# EAGLE schematic ina_board (EAGLE 9.6.2)
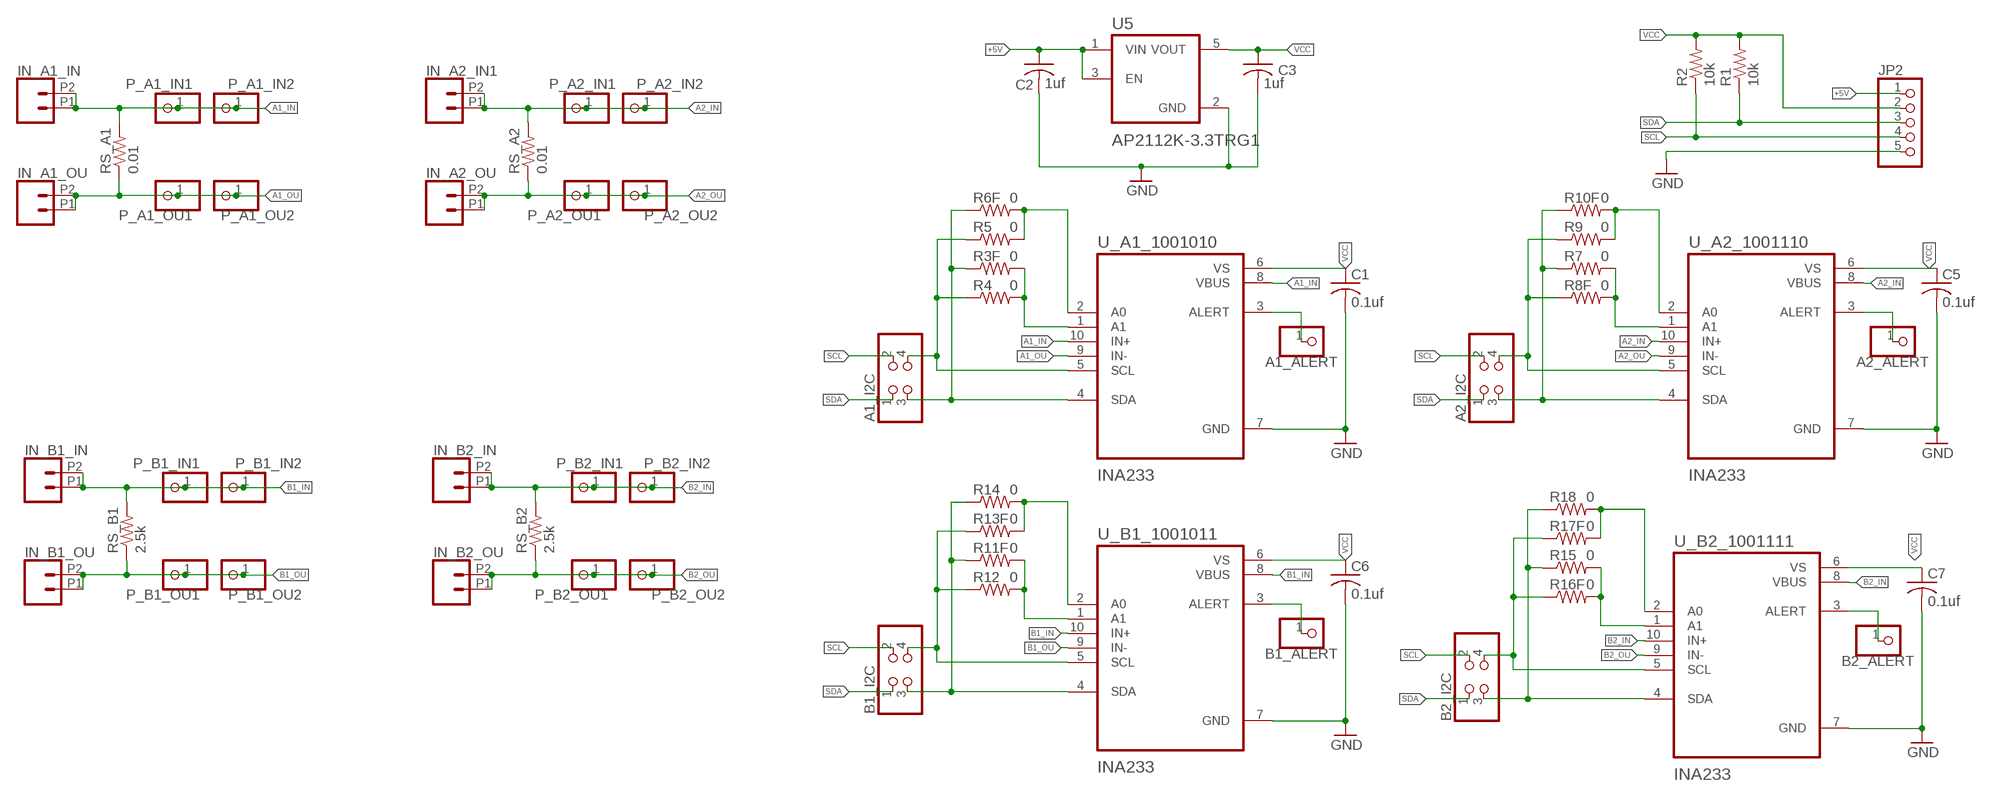
[diagram p0: schematic, sheet 1]

## Parts
A1_ALERT  PINHD-1X1  [1X01]
A1_I2C  PINHD-2X2  [2X02]
A2_ALERT  PINHD-1X1  [1X01]
A2_I2C  PINHD-2X2  [2X02]
B1_ALERT  PINHD-1X1  [1X01]
B1_I2C  PINHD-2X2  [2X02]
B2_ALERT  PINHD-1X1  [1X01]
B2_I2C  PINHD-2X2  [2X02]
C1  0.1uf  C-USC0805  [C0805]
C2  1uf  C-USC1210  [C1210]
C3  1uf  C-USC1210  [C1210]
C5  0.1uf  C-USC0805  [C0805]
C6  0.1uf  C-USC0805  [C0805]
C7  0.1uf  C-USC0805  [C0805]
IN_A1_IN  CONN_022.54MM_SCREWTERM  [1X02_2.54_SCREWTERM]
IN_A1_OU  CONN_022.54MM_SCREWTERM  [1X02_2.54_SCREWTERM]
IN_A2_IN1  CONN_022.54MM_SCREWTERM  [1X02_2.54_SCREWTERM]
IN_A2_OU  CONN_022.54MM_SCREWTERM  [1X02_2.54_SCREWTERM]
IN_B1_IN  CONN_022.54MM_SCREWTERM  [1X02_2.54_SCREWTERM]
IN_B1_OU  CONN_022.54MM_SCREWTERM  [1X02_2.54_SCREWTERM]
IN_B2_IN  CONN_022.54MM_SCREWTERM  [1X02_2.54_SCREWTERM]
IN_B2_OU  CONN_022.54MM_SCREWTERM  [1X02_2.54_SCREWTERM]
JP2  PINHD-1X5  [1X05]
P_A1_IN1  PINHD-1X1  [1X01]
P_A1_IN2  PINHD-1X1  [1X01]
P_A1_OU1  PINHD-1X1  [1X01]
P_A1_OU2  PINHD-1X1  [1X01]
P_A2_IN1  PINHD-1X1  [1X01]
P_A2_IN2  PINHD-1X1  [1X01]
P_A2_OU1  PINHD-1X1  [1X01]
P_A2_OU2  PINHD-1X1  [1X01]
P_B1_IN1  PINHD-1X1  [1X01]
P_B1_IN2  PINHD-1X1  [1X01]
P_B1_OU1  PINHD-1X1  [1X01]
P_B1_OU2  PINHD-1X1  [1X01]
P_B2_IN1  PINHD-1X1  [1X01]
P_B2_IN2  PINHD-1X1  [1X01]
P_B2_OU1  PINHD-1X1  [1X01]
P_B2_OU2  PINHD-1X1  [1X01]
R1  10k  R-US_R0805  [R0805]
R2  10k  R-US_R0805  [R0805]
R3F  0  R-US_R0805  [R0805]
R4  0  R-US_R0805  [R0805]
R5  0  R-US_R0805  [R0805]
R6F  0  R-US_R0805  [R0805]
R7  0  R-US_R0805  [R0805]
R8F  0  R-US_R0805  [R0805]
R9  0  R-US_R0805  [R0805]
R10F  0  R-US_R0805  [R0805]
R11F  0  R-US_R0805  [R0805]
R12  0  R-US_R0805  [R0805]
R13F  0  R-US_R0805  [R0805]
R14  0  R-US_R0805  [R0805]
R15  0  R-US_R0805  [R0805]
R16F  0  R-US_R0805  [R0805]
R17F  0  R-US_R0805  [R0805]
R18  0  R-US_R0805  [R0805]
RS_A1  0.01  R-US_R2512  [R2512]
RS_A2  0.01  R-US_R2512  [R2512]
RS_B1  2.5k  R-US_R0805  [R0805]
RS_B2  2.5k  R-US_R0805  [R0805]
U5  AP2112K-3.3TRG1  [SOT95P285X140-5N]
U_A1_1001010  INA233  INA226AIDGST  [SOP50P490X110-10N]
U_A2_1001110  INA233  INA226AIDGST  [SOP50P490X110-10N]
U_B1_1001011  INA233  INA226AIDGST  [SOP50P490X110-10N]
U_B2_1001111  INA233  INA226AIDGST  [SOP50P490X110-10N]

## Nets
+5V: C2.1 JP2.1 U5.1(VIN) U5.3(EN)
A1_IN: IN_A1_IN.P1 IN_A1_IN.P2 P_A1_IN1.1 P_A1_IN2.1 RS_A1.2 U_A1_1001010.8(VBUS) U_A1_1001010.10(IN+)
A1_OU: IN_A1_OU.P1 IN_A1_OU.P2 P_A1_OU1.1 P_A1_OU2.1 RS_A1.1 U_A1_1001010.9(IN-)
A2_IN: IN_A2_IN1.P1 IN_A2_IN1.P2 P_A2_IN1.1 P_A2_IN2.1 RS_A2.2 U_A2_1001110.8(VBUS) U_A2_1001110.10(IN+)
A2_OU: IN_A2_OU.P1 IN_A2_OU.P2 P_A2_OU1.1 P_A2_OU2.1 RS_A2.1 U_A2_1001110.9(IN-)
B1_IN: IN_B1_IN.P1 IN_B1_IN.P2 P_B1_IN1.1 P_B1_IN2.1 RS_B1.2 U_B1_1001011.8(VBUS) U_B1_1001011.10(IN+)
B1_OU: IN_B1_OU.P1 IN_B1_OU.P2 P_B1_OU1.1 P_B1_OU2.1 RS_B1.1 U_B1_1001011.9(IN-)
B2_IN: IN_B2_IN.P1 IN_B2_IN.P2 P_B2_IN1.1 P_B2_IN2.1 RS_B2.2 U_B2_1001111.8(VBUS) U_B2_1001111.10(IN+)
B2_OU: IN_B2_OU.P1 IN_B2_OU.P2 P_B2_OU1.1 P_B2_OU2.1 RS_B2.1 U_B2_1001111.9(IN-)
GND: C1.2 C2.2 C3.2 C5.2 C6.2 C7.2 JP2.5 U5.2(GND) U_A1_1001010.7(GND) U_A2_1001110.7(GND) U_B1_1001011.7(GND) U_B2_1001111.7(GND)
N$3: A2_I2C.4 R8F.1 R9.1 U_A2_1001110.5(SCL)
N$4: A2_I2C.3 R7.1 R10F.1 U_A2_1001110.4(SDA)
N$5: A1_ALERT.1 U_A1_1001010.3(ALERT)
N$6: R7.2 R8F.2 U_A2_1001110.1(A1)
N$7: A1_I2C.4 R4.1 R5.1 U_A1_1001010.5(SCL)
N$8: A1_I2C.3 R3F.1 R6F.1 U_A1_1001010.4(SDA)
N$9: R3F.2 R4.2 U_A1_1001010.1(A1)
N$10: R5.2 R6F.2 U_A1_1001010.2(A0)
N$11: R9.2 R10F.2 U_A2_1001110.2(A0)
N$12: A2_ALERT.1 U_A2_1001110.3(ALERT)
N$17: B1_I2C.4 R12.1 R13F.1 U_B1_1001011.5(SCL)
N$18: B1_I2C.3 R11F.1 R14.1 U_B1_1001011.4(SDA)
N$19: R11F.2 R12.2 U_B1_1001011.1(A1)
N$20: R13F.2 R14.2 U_B1_1001011.2(A0)
N$21: B1_ALERT.1 U_B1_1001011.3(ALERT)
N$26: B2_I2C.4 R16F.1 R17F.1 U_B2_1001111.5(SCL)
N$27: B2_I2C.3 R15.1 R18.1 U_B2_1001111.4(SDA)
N$28: R15.2 R16F.2 U_B2_1001111.1(A1)
N$29: R17F.2 R18.2 U_B2_1001111.2(A0)
N$30: B2_ALERT.1 U_B2_1001111.3(ALERT)
SCL: A1_I2C.2 A2_I2C.2 B1_I2C.2 B2_I2C.2 JP2.4 R2.1
SDA: A1_I2C.1 A2_I2C.1 B1_I2C.1 B2_I2C.1 JP2.3 R1.1
VCC: C1.1 C3.1 C5.1 C6.1 C7.1 JP2.2 R1.2 R2.2 U5.5(VOUT) U_A1_1001010.6(VS) U_A2_1001110.6(VS) U_B1_1001011.6(VS) U_B2_1001111.6(VS)

## Library data of the parts
A1_ALERT A2_ALERT B1_ALERT B2_ALERT = pinhead:PINHD-1X1: PIN HEADER
A1_I2C A2_I2C B1_I2C B2_I2C = pinhead:PINHD-2X2: PIN HEADER
C1-C3 C5-C7 = rcl:C-US: CAPACITOR, American symbol; SPICEPREFIX: C
IN_A1_IN IN_A1_OU IN_A2_IN1 IN_A2_OU IN_B1_IN IN_B1_OU IN_B2_IN IN_B2_OU = SparkFun-Connectors:CONN_02: Multi connection point. Often used as Generic Header-pin footprint for 0.1 inch spaced/style header connections On any of the 0.1 inch spaced packages, you can populate with these: Break Away Headers - Straight <https://www.sparkfun.com/products/116> (PRT-00116) Break Away Male Headers - Right Angle <https://www.sparkfun.com/products/553> (PRT-00553) Female Headers <https://www.sparkfun.com/products/115> (PRT-00115) Break Away Headers - Machine Pin <https://www.sparkfun.com/products/117> (PRT-00117) Break Away Female Headers - Swiss Machine Pin <https://www.sparkfun.com/products/743> (PRT-00743) For SCREWTERMINALS and SPRING TERMINALS visit here: Screw Terimnals on SparkFun.com <https://www.sparkfun.com/search/results?term=Screw+Terminals> (5mm/3.5mm/2.54mm spacing) This device is also useful as a general connection point to wire up your design to another part of your project. Our various solder wires solder well into these plated through hole pads. Hook-Up Wire - Assortment (Stranded, 22 AWG) <https://www.sparkfun.com/products/11375> (PRT-11375) Hook-Up Wire - Assortment (Solid Core, 22 AWG) <https://www.sparkfun.com/products/11367> (PRT-11367) View the entire wire category on our website here <https://www.sparkfun.com/categories/141> Special notes: Molex polarized connector foot print use with: PRT-08233 with associated crimp pins and housings. 2.54_SCREWTERM for use with PRT-10571. 3.5mm Screw Terminal footprints for PRT-08084 5mm Screw Terminal footprints for use with PRT-08432
JP2 = pinhead:PINHD-1X5: PIN HEADER
P_A1_IN1 P_A1_IN2 P_A1_OU1 P_A1_OU2 P_A2_IN1 P_A2_IN2 P_A2_OU1 P_A2_OU2 P_B1_IN1 P_B1_IN2 P_B1_OU1 P_B1_OU2 P_B2_IN1 P_B2_IN2 P_B2_OU1 P_B2_OU2 = Connector:PINHD-1X1: PIN HEADER; CATEGORY: CONNECTOR; SUB-CATEGORY: PIN-HEADER
R1 R2 R3F R4 R5 R6F R7 R8F R9 R10F R11F R12 R13F R14 R15 R16F R17F R18 RS_A1 RS_A2 RS_B1 RS_B2 = rcl:R-US_: RESISTOR, American symbol; SPICEPREFIX: R
U5 = AP2112K-3.3TRG1:AP2112K-3.3TRG1: AP2112 Series 0.6 A 3.3 V Fixed Output SMT LDO Linear Regulator - SOT23-5 Check availability <https://pricing.snapeda.com/parts/AP2112K-3.3TRG1/Diodes%20Inc./view-part?ref=eda>; AVAILABILITY: In Stock; DESCRIPTION: Linear Voltage Regulator IC Positive Fixed 1 Output 600mA SOT-25; MF: Diodes Inc.; MP: AP2112K-3.3TRG1; PACKAGE: SOT-753 Diodes Inc.; PRICE: None; PURCHASE-URL: https://pricing.snapeda.com/search/part/AP2112K-3.3TRG1/?ref=eda
U_A1_1001010 U_A2_1001110 U_B1_1001011 U_B2_1001111 = INA226AIDGST:INA226AIDGST: Check availability <https://pricing.snapeda.com/parts/INA226AIDGST/Texas%20Instruments/view-part?ref=eda>; AVAILABILITY: In Stock; DESCRIPTION: 36V, 16-bit, ultra-precise i2c output current/voltage/power monitor w/alert; MF: Texas Instruments; MP: INA226AIDGST; PACKAGE: VSSOP-10 Texas Instruments; PRICE: None; PURCHASE-URL: https://pricing.snapeda.com/search/part/INA226AIDGST/?ref=eda